# Altium project MotorBase.PrjPcb
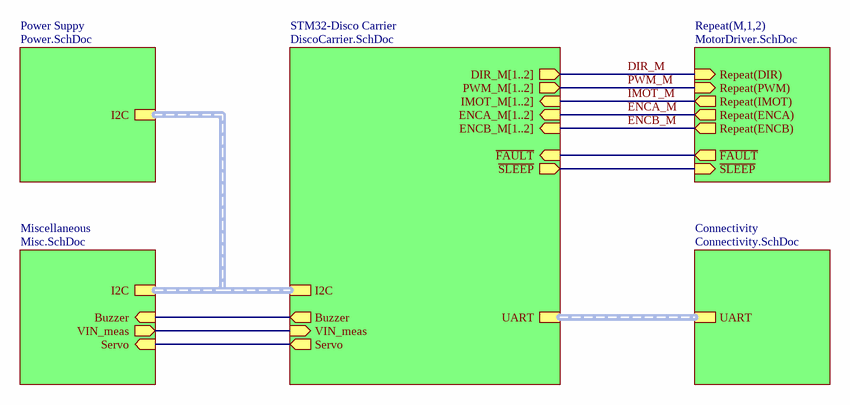
[diagram p0: Top.SchDoc]
seAuthor: Stefan Lüthi; seProject: robby; seRevision: 1.0
6 sheets, 85 parts. Net scope: hierarchical (ports join the sheet entries above them; power ports are global).
Board file: MotorBase.PcbDoc
Sheets:
  Top.SchDoc
    STM32-Disco Carrier = DiscoCarrier.SchDoc
    Miscellaneous = Misc.SchDoc
    M1 = MotorDriver.SchDoc
    M2 = MotorDriver.SchDoc
    Power Suppy = Power.SchDoc
    Connectivity = Connectivity.SchDoc

## Sheet Top.SchDoc
size A4; SheetNumber: 1; SheetTotal: 6

### Sub-sheets
Connectivity = Connectivity.SchDoc: UART (harness UART)
Miscellaneous = Misc.SchDoc: Buzzer (in), I2C (harness I2C), VIN_meas (out), Servo (in)
Power Suppy = Power.SchDoc: I2C (harness I2C)
Repeat(M,1,2) = MotorDriver.SchDoc: ~{FAULT} (out), ~{SLEEP} (in), Repeat(DIR) (in), Repeat(PWM) (in), Repeat(IMOT) (out), Repeat(ENCA) (out), Repeat(ENCB) (out)
STM32-Disco Carrier = DiscoCarrier.SchDoc: ~{FAULT} (in), ~{SLEEP} (out), DIR_M[1..2] (out), PWM_M[1..2] (out), IMOT_M[1..2] (in), ENCA_M[1..2] (in), ENCB_M[1..2] (in), UART (harness UART), Buzzer (out), I2C (harness I2C), VIN_meas (in), Servo (out)

### Nets
Buz: sheet STM32-Disco Carrier/Buzzer, sheet Miscellaneous/Buzzer
DIR_M: sheet Repeat(M,1,2)/Repeat(DIR)
ENCA_M: sheet Repeat(M,1,2)/Repeat(ENCA)
ENCB_M: sheet Repeat(M,1,2)/Repeat(ENCB)
~{FAULT}: sheet STM32-Disco Carrier/~{FAULT}, sheet Repeat(M,1,2)/~{FAULT}
IMOT_M: sheet Repeat(M,1,2)/Repeat(IMOT)
PWM_M: sheet Repeat(M,1,2)/Repeat(PWM)
~{SLEEP}: sheet STM32-Disco Carrier/~{SLEEP}, sheet Repeat(M,1,2)/~{SLEEP}
VIN_meas: sheet STM32-Disco Carrier/VIN_meas, sheet Miscellaneous/VIN_meas
NetP304_6: sheet STM32-Disco Carrier/Servo, sheet Miscellaneous/Servo

### Buses and harness runs
harness sheet Connectivity/UART = sheet STM32-Disco Carrier/UART
harness sheet Miscellaneous/I2C = sheet Power Suppy/I2C = sheet STM32-Disco Carrier/I2C

### Notes on the sheet
- Project:
- Board:
- Title:
- Size:
- Sheet:
- A4
- of
- Drawn by:
- Revision:
- Date:
- Variant:
- Source Engineers GmbH | CH-3012 Bern
- File:

## Sheet DiscoCarrier.SchDoc
size A4; SheetNumber: 3; SheetTotal: 6
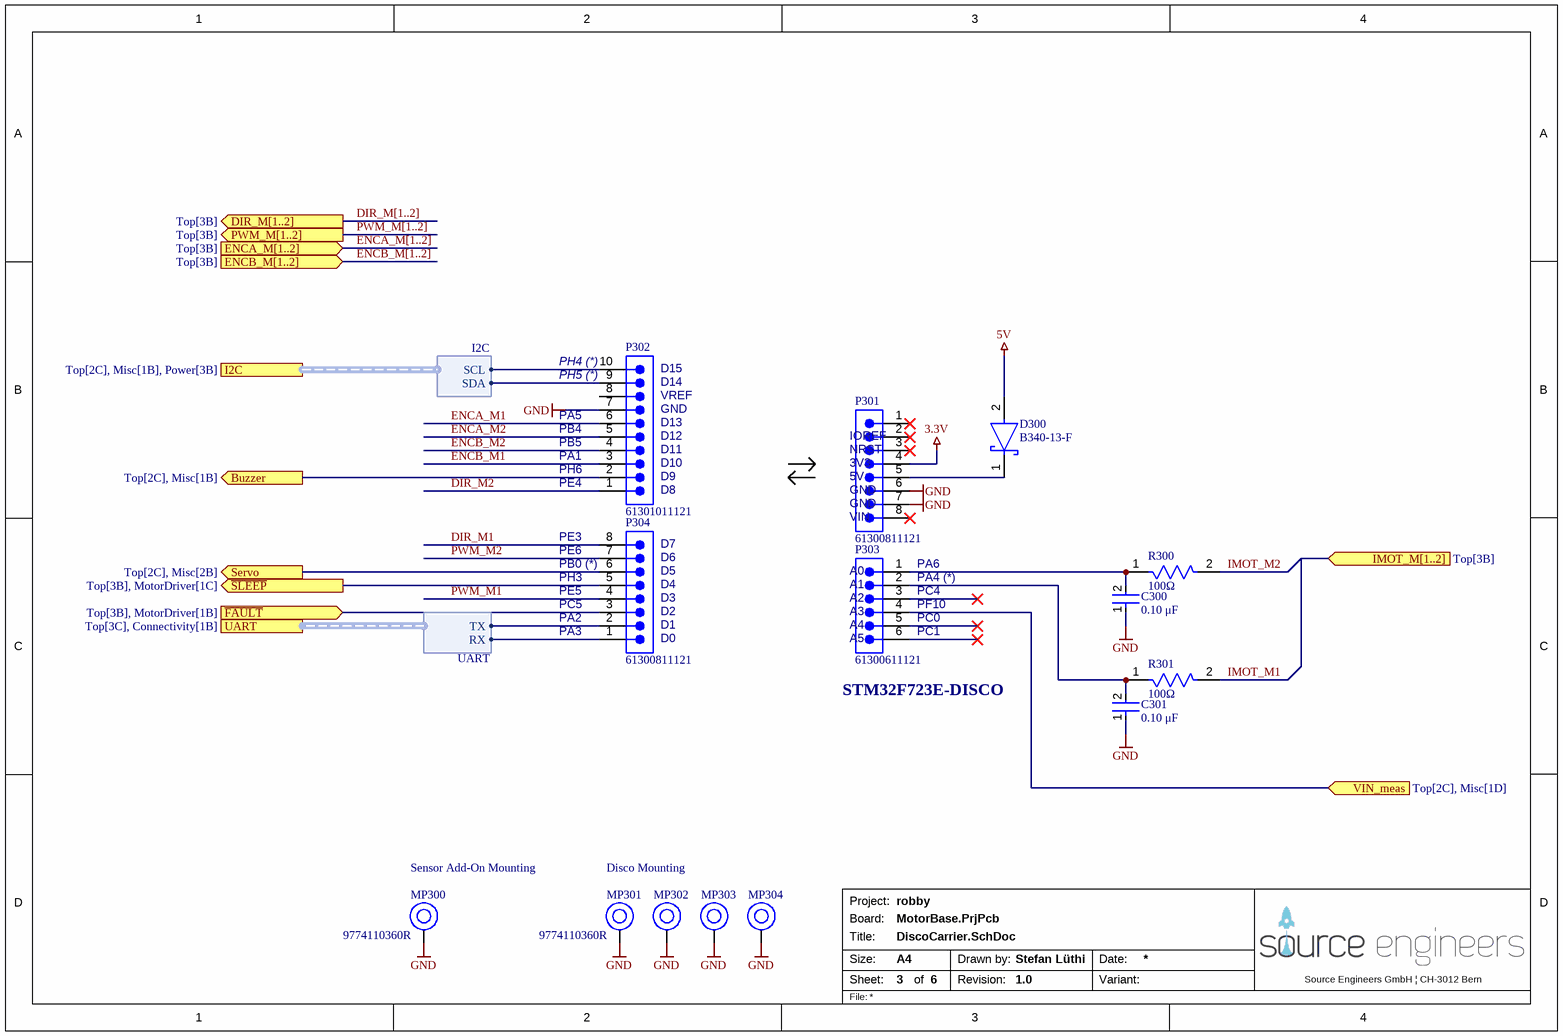
[diagram p1: DiscoCarrier.SchDoc]

### Parts
C300  value 0.10 μF  [FP-C0603C-CF-MFG]  (hidden comment: C0603C104M5RACTU)
C301  value 0.10 μF  [FP-C0603C-CF-MFG]  (hidden comment: C0603C104M5RACTU)
D300  B340-13-F  [FP-SMC-MFG]
MP300  9774110360R  [9774110360]
MP301  9774110360R  [9774110360]
MP302  9774110360R  [9774110360]  (value not drawn)
MP303  9774110360R  [9774110360]  (value not drawn)
MP304  9774110360R  [9774110360]  (value not drawn)
P301  61300811121  [61300811121]
P302  61301011121  [61301011121]
P303  61300611121  [61300611121]
P304  61300811121  [61300811121]
R300  Resistance: 100Ω  [FP-RT0603-MFG]  (hidden comment: RT0603FRE07100RL)
R301  Resistance: 100Ω  [FP-RT0603-MFG]  (hidden comment: RT0603FRE07100RL)

### Ports
Buzzer (out, see Top[2C], Misc[1B]), DIR_M[1..2] (out, see Top[3B]), ENCA_M[1..2] (in, see Top[3B]), ENCB_M[1..2] (in, see Top[3B]), I2C (harness I2C, see Top[2C], Misc[1B], Power[3B]), IMOT_M[1..2] (in, see Top[3B]), PWM_M[1..2] (out, see Top[3B]), Servo (out, see Top[2C], Misc[2B]), UART (harness UART, see Top[3C], Connectivity[1B]), VIN_meas (in, see Top[2C], Misc[1D]), ~{FAULT} (in, see Top[3B], MotorDriver[1B]), ~{SLEEP} (out, see Top[3B], MotorDriver[1C])

### Harnesses
UART: TX, RX
I2C: SCL, SDA

### Nets
3.3V: P301.4
5V: D300.2(A)
GND: C300.1 C301.1 MP300.1 MP301.1 MP302.1 MP303.1 MP304.1 P301.6 P301.7 P302.7
Buz: P302.2 ; port Buzzer
DIR_M1: P304.8
DIR_M2: P302.1
ENCA_M1: P302.6
ENCA_M2: P302.5
ENCB_M1: P302.3
ENCB_M2: P302.4
~{FAULT}: P304.3 ; port ~{FAULT}
IMOT_M1: R301.2
IMOT_M2: R300.2
PWM_M1: P304.4
PWM_M2: P304.7
~{SLEEP}: P304.5 ; port ~{SLEEP}
SCL: P302.10 ; port I2C.SCL
SDA: P302.9 ; port I2C.SDA
VIN_meas: P303.4 ; port VIN_meas
XIAO_RX: P304.2 ; port UART.TX
XIAO_TX: P304.1 ; port UART.RX
NetC300_2: C300.2 P303.1 R300.1
NetC301_2: C301.2 P303.2 R301.1
NetD300_1: D300.1(C) P301.5
NetP304_6: P304.6 ; port Servo

Not connected (* = marked no-connect by the designer): P301 1* 2* 3* 8*; P302 8; P303 3* 5* 6*

### Buses and harness runs
bus DIR_M[1..2] = port DIR_M[1..2]
bus ENCA_M[1..2] = port ENCA_M[1..2]
bus ENCB_M[1..2] = port ENCB_M[1..2]
bus PWM_M[1..2] = port PWM_M[1..2]

### Notes on the sheet
- (near P302) PH4 (*)
- (near P302) PH5 (*)
- (near P302) D14
- (near P302) D15
- (near P302) PB5
- (near P302) PB4
- (near P302) PA5
- (near P302) VREF
- (near P302) GND
- (near P302) D12
- (near P302) D13
- (near P301) IOREF
- (near P302) PA1
- PE4
- (near P302) PH6
- (near P302) D8
- (near P302) D9
- (near P302) D10
- (near P302) D11
- (near P301) NRST
- (near P301) 3V3
- (near P301) 5V
- (near P301) GND
- (near P301) VIN
- (near P304) PH3
- PE6
- PE3
- (near P304) PB0 (*)
- (near P304) D5
- (near P304) D6
- (near P304) D7
- (near P303) A0
- PA6
- (near P303) PA4 (*)
- (near P304) PA2
- (near P304) PC5
- (near P304) PE5
- (near P304) PA3
- (near P304) D0
- (near P304) D1
- (near P304) D2
- (near P304) D3
- (near P304) D4
- (near P303) A1
- (near P303) A2
- (near P303) A3
- (near P303) A4
- (near P303) A5
- (near P303) PC4
- (near P303) PF10
- (near P303) PC0
- (near P303) PC1
- STM32F723E-DISCO
- Sensor Add-On Mounting
- Disco Mounting
- Project:
- Board:
- Title:
- Size:
- Sheet:
- of
- Drawn by:
- Revision:
- Date:
- Variant:
- Source Engineers GmbH | CH-3012 Bern
- File:

### Library data of the parts
C300 C301 = CMP-2006-03068-2: CAP CER 0.1UF 50V 20% X7R 0603; Manufacturer: KEMET; Material: Ceramic; Tolerance: 0.2; Temperature Coefficient: 30ppm/°C; Automotive Grade: Grade 1; Temperature Range High: +125°C; Voltage Rating: 50 V; Device Class L3: Ceramic Capacitors; Manufacturer Part Number: C0603C104M5RACTU; Height: 0.87mm; Category: Cap; RoHS: TRUE; Digikey Description: CAP CER 0.1UF 50V 20% X7R 0603; ComponentLink2URL: https://api.kemet.com/component-edge/download/datasheet/C0603C100J5GACAUTO.pdf; Lead Free: Yes; Temperature Range Low: -55°C; Device Class L1: Passive Components; ComponentLink2Description: Datasheet; Temperature Characteristic: X7R; Automotive: Yes; Temperature: -55°C to +125°C; Octopart: https://octopart.com/c0603c104m5ractu-kemet-11855687; Device Class L2: Capacitors; Package: C0603C-CF; Mouser Description: Multilayer Ceramic Capacitors MLCC - SMD/SMT 50volts 0.1uF X7R 20%; Capacitance: 0.10 μF
D300 = CMP-12790-000049-1: DIODE SCHOTTKY 40V 3A SMC; Manufacturer: Diodes Inc.; Max Surge Forward Current: 100A; Peak Reverse Current: 0.1mA; Max Junction Temp: +150°C; Value: 200pF; Standoff Height: 0.1mm; Temperature: -55°C to +150°C; Reverse Voltage: 40V; Max Repetitive Reverse Voltage: 40V; Forward Current: 3A; Device Class L2: Diodes; RoHS: TRUE; Footprint Url: https://www.diodes.com/assets/Package-Files/SMC.pdf; Digikey Description: DIODE SCHOTTKY 40V 3A SMC; Package: SMC; Category: Diode; ComponentLink2Description: Datasheet; Temperature Range High: +150°C; Lead Free: Yes; Mouser Description: Diode Schottky 40V 3A 2-Pin SMC T/R Diode Schottky 40V 3A 2-Pin SMC T/R; Manufacturer Part Number: B340-13-F; Octopart: https://octopart.com/b340-13-f-diodes+inc.-325814; Automotive: No; ComponentLink2URL: https://www.diodes.com/assets/Datasheets/ds30923.pdf; Capacitance: 200pF; Device Class L1: Discrete Semiconductors; Temperature Range Low: -55°C; Height: 2.5mm; Device Class L3: Schottky Diodes
MP300-MP304 = CMP-03913-39399854-1: 9774110360R Spacer Material: Steel, Tin-Plated Mounting: SMT Series: WA-SMSI Thread D: M3; Plating: Tin; Threaded/Unthreaded: Threaded; Outside Diameter: 5.9944mm; Length: 11mm; Min Operating Temperature: -55°C; NexarPartId: 39399854; Packaging: Tape and Reel; Material: Steel; Thread Size: M3; Width: 6mm; REACH SVHC: Unknown; Max Operating Temperature: 150°C; Height: 11.1mm; Lead Free: Lead Free; RoHS: Compliant; Case/Package: SMD/SMT; Mount: External
P301 P304 = CMP-1502-01076-3: NexarPartId: 32855533; Connector Type: Male Pin; Number of Contacts: 8; Voltage Rating: 250V; Current Rating: 3A; Contact Resistance: 20mΩ; Pitch: 2.54mm; Gender: Male; Termination: Solder; Contact Material: Copper; Mount: Through Hole; Lead Pitch: 2.54mm; Number of Positions: 8; Operating Supply Voltage: 250V; Number of Pins: 8; Max Operating Temperature: 105°C; Height: 8.54mm; REACH SVHC: Unknown; Number of Rows: 1; Packaging: Bulk; Contact Plating: Gold; Contact Mating Length: 5.9944mm; Orientation: Vertical; RoHS: Compliant; Color: Black; Min Operating Temperature: -40°C
P302 = CMP-1502-01082-5: NexarPartId: 18818159; Gender: Male; Number of Positions: 10; Operating Supply Voltage: 250V; Current Rating: 3A; Contact Resistance: 20mΩ; Connector Type: Male Pin; Insulation Resistance: 1GΩ; Pitch: 2.54mm; Color: Black; Contact Gender: Male; Height: 8.74mm; Orientation: Vertical; RoHS: Compliant; Packaging: Bulk; Min Operating Temperature: -40°C; Number of Pins: 10; Max Operating Temperature: 105°C; REACH SVHC: Unknown; Voltage Rating: 250V; Number of Rows: 1; Housing Material: PBT; Number of Contacts: 10; Mount: Through Hole; Contact Mating Length: 5.9944mm; Length: 2.54mm; Lead Pitch: 2.54mm; Flammability Rating: UL94 V-0; Termination: Solder; Contact Material: Copper; Width: 25.4mm; Contact Plating: Gold
P303 = CMP-1502-01070-3: NexarPartId: 20084590; Current Rating: 3A; Pitch: 2.54mm; Gender: Male; Operating Supply Voltage: 250V; Connector Type: Male Pin; Number of Positions: 6; Contact Resistance: 20mΩ; Packaging: Bulk; Number of Pins: 6; Number of Rows: 1; Contact Plating: Gold; Lead Free: Lead Free; RoHS: Compliant; Contact Mating Length: 5.9944mm; Voltage Rating: 250V; REACH SVHC: Unknown; Contact Gender: Male; Housing Material: PBT; Min Operating Temperature: -40°C; Lead Pitch: 2.54mm; Mount: Through Hole; Number of Contacts: 6; Max Operating Temperature: 105°C; Contact Material: Copper; Orientation: Vertical; Termination: Through Hole; Color: Black; Height: 8.89mm
R300 R301 = CMP-03412-022806-1: RES SMD 100 OHM 1% 1/10W 0603; Manufacturer: Yageo; Value: 100Ω; Power Rating: 0.1W; Voltage Rating: 75V; Temperature Coefficient: 50 ppm/°C; Tolerance: 0.01; Manufacturer Part Number: RT0603FRE07100RL; Mouser Description: Thin Film Resistors - SMD 1/10W 100 ohm 1% 50ppm; Ipc Land Pattern Name: RESC16080X45; Height: 0.55mm; Category: Res; Temperature Range Low: -55°C; Lead Free: Yes; Automotive: No; Device Class L3: Chip SMD Resistors; ComponentLink2Description: Datasheet; Device Class L2: Resistors; RoHS: TRUE; Footprint Url: http://www.yageo.com/exep/pages/download/literatures/PYu-R_Mount_10.pdf; Digikey Description: RES SMD 100 OHM 1% 1/10W 0603; Temperature Range High: +155°C; Package: RT0603; Device Class L1: Passive Components; Series: RT; Temperature: -55°C to +155°C; Octopart: https://octopart.com/rt0603fre07100rl-yageo-39792638; Composition: Thin Film; ComponentLink2URL: http://www.yageo.com/documents/recent/PYu-RT_1-to-0.01_RoHS_L_9.pdf

## Sheet Misc.SchDoc
size A4; SheetNumber: 6; SheetTotal: 6
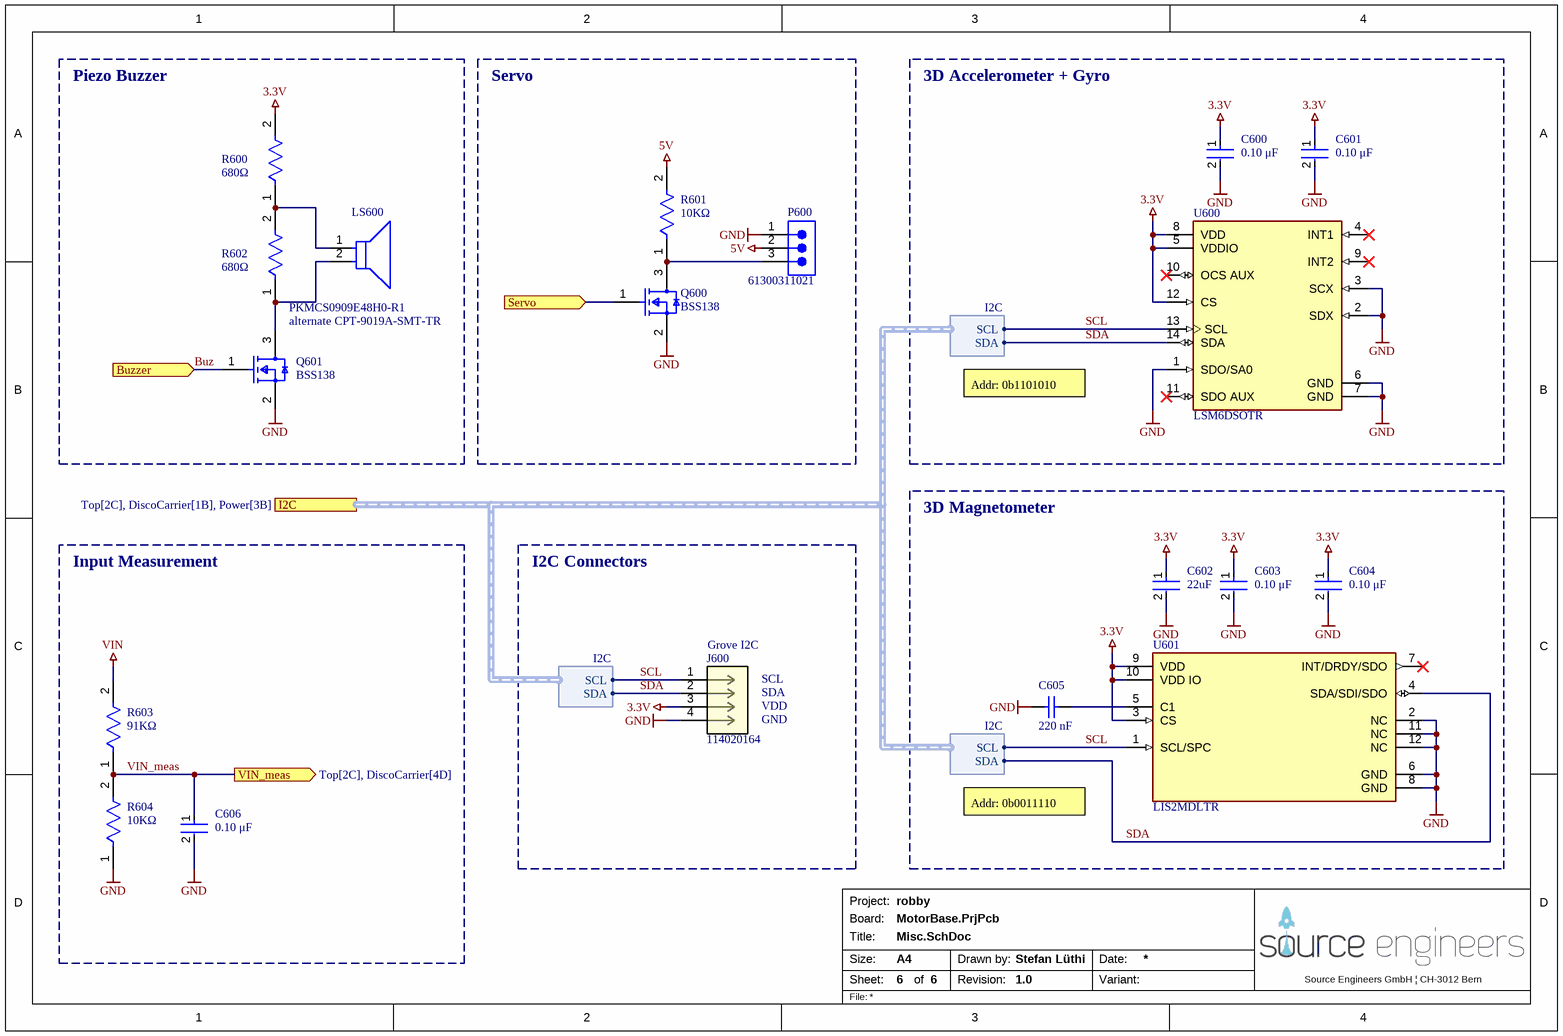
[diagram p2: Misc.SchDoc]

### Parts
C600  value 0.10 μF  [FP-C0603C-CF-MFG]  (hidden comment: C0603C104M5RACTU)
C601  value 0.10 μF  [FP-C0603C-CF-MFG]  (hidden comment: C0603C104M5RACTU)
C602  Capacitance: 22uF  [FP-GRM319-0_15-IPC_C]  (hidden comment: GRM319R61C226ME15D)
C603  value 0.10 μF  [FP-C0603C-CF-MFG]  (hidden comment: C0603C104M5RACTU)
C604  value 0.10 μF  [FP-C0603C-CF-MFG]  (hidden comment: C0603C104M5RACTU)
C605  value 220 nF  [CAPC1608X90X35NL15T15]  (hidden comment: C0603C224Z4VACTU)
C606  value 0.10 μF  [FP-C0603C-CF-MFG]  (hidden comment: C0603C104M5RACTU)
J600  114020164  [CONN4_20164_SEE]
LS600  PKMCS0909E48H0-R1  [FP-PKMCS0909E48H0-R1-MFG]
P600  61300311021  [61300311021]
Q600  BSS138  [FP-318-08-IPC_B]
Q601  BSS138  [FP-318-08-IPC_B]
R600  value 680Ω  [FP-RT0603-MFG]  (hidden comment: RT0603FRE07680RL)
R601  value 10KΩ  [FP-RT0603-MFG]  (hidden comment: RT0603FRE0710KL)
R602  value 680Ω  [FP-RT0603-MFG]  (hidden comment: RT0603FRE07680RL)
R603  Resistance: 91KΩ  [FP-RT0603-MFG]  (hidden comment: RT0603FRE0791KL)
R604  value 10KΩ  [FP-RT0603-MFG]  (hidden comment: RT0603FRE0710KL)
U600  LSM6DSOTR  [FP-LGA-14L-DM00249496-MFG]
U601  LIS2MDLTR  [FP-LGA-12-DM00170568-MFG]

### Blocks framed on the sheet
Piezo Buzzer: LS600 Q601 R600 R602
Servo: P600 Q600 R601
3D Accelerometer + Gyro: C600 C601 U600
3D Magnetometer: C602-C605 U601
Input Measurement: C606 R603 R604
I2C Connectors: J600

### Ports
Buzzer (in, see Top[2C], DiscoCarrier[1B]), I2C (harness I2C, see Top[2C], DiscoCarrier[1B], Power[3B]), Servo (in, see Top[2C], DiscoCarrier[1C]), VIN_meas (out, see Top[2C], DiscoCarrier[4D])

### Harnesses
I2C: SCL, SDA

### Nets
3.3V: C600.1 C601.1 C602.1 C603.1 C604.1 J600.3 R600.2 U600.5(VDDIO) U600.8(VDD) U600.12(CS) U601.3(CS) U601.9(VDD) U601.10(VDD_IO)
5V: P600.2 R601.2
GND: C600.2 C601.2 C602.2 C603.2 C604.2 C605.1 C606.2 J600.4 P600.1 Q600.2(S) Q601.2(S) R604.1 U600.1(SDO/SA0) U600.2(SDX) U600.3(SCX) U600.6(GND) U600.7(GND) U601.2(NC) U601.6(GND) U601.8(GND) U601.11(NC) U601.12(NC)
VIN: R603.2
Buz: Q601.1(G) ; port Buzzer
SCL: J600.1 U600.13(SCL) U601.1(SCL/SPC) ; port I2C.SCL
SDA: J600.2 U600.14(SDA) U601.4(SDA/SDI/SDO) ; port I2C.SDA
VIN_meas: C606.1 R603.1 R604.2 ; port VIN_meas
NetC605_2: C605.2 U601.5(C1)
NetLS600_1: LS600.1 R600.1 R602.2
NetLS600_2: LS600.2 Q601.3(D) R602.1
NetP304_6: Q600.1(G) ; port Servo
NetP600_3: P600.3 Q600.3(D) R601.1

Not connected (* = marked no-connect by the designer): U600 4(INT1)* 9(INT2)* 10(OCS_AUX)* 11(SDO_AUX)*; U601 7(INT/DRDY/SDO)*

### Notes on the sheet
- alternate CPT-9019A-SMT-TR
- Addr: 0b1101010
- (near J600) Grove I2C
- SCL
- SDA
- VDD
- GND
- Addr: 0b0011110
- Project:
- Board:
- Title:
- Size:
- Sheet:
- A4
- of
- Drawn by:
- Revision:
- Date:
- Variant:
- Source Engineers GmbH | CH-3012 Bern
- File:

### Library data of the parts
C600 C601 C603 C604 C606 = CMP-2006-03068-2: as C300 on sheet DiscoCarrier; Temperature Range High: +125°C; Voltage Rating: 50 V; Device Class L3: Ceramic Capacitors; Manufacturer Part Number: C0603C104M5RACTU; Height: 0.87mm; Category: Cap; RoHS: TRUE; Digikey Description: CAP CER 0.1UF 50V 20% X7R 0603; ComponentLink2URL: https://api.kemet.com/component-edge/download/datasheet/C0603C100J5GACAUTO.pdf; Lead Free: Yes; Temperature Range Low: -55°C; Device Class L1: Passive Components; ComponentLink2Description: Datasheet; Temperature Characteristic: X7R; Automotive: Yes; Temperature: -55°C to +125°C; Octopart: https://octopart.com/c0603c104m5ractu-kemet-11855687; Device Class L2: Capacitors; Package: C0603C-CF; Mouser Description: Multilayer Ceramic Capacitors MLCC - SMD/SMT 50volts 0.1uF X7R 20%; Capacitance: 0.10 μF
C602 = CMP-06035-037955-1: Chip Multilayer Ceramic Capacitors for General Purpose, 1206, 22uF, X5R, 15%, 20%, 16V; Weight: 0.001411oz; Case/Package: 1206; Mount: Surface Mount; Voltage Rating (DC): 16V; Case Code (Metric): 3216; Height: 0.85mm; Package Quantity: 4000; Resistor Type: Ceramic; Thickness: 0.037inch; Packaging: Tape and Reel; Dielectric: X5R; Tolerance: 20%; Case Code (Imperial): 1206; Width: 0.063inch; Termination: SMD/SMT; Voltage Rating: 16V; Length: 0.126inch; Min Operating Temperature: -55°C; Max Operating Temperature: 85°C
C605 = CMP-2006-02254-1: Manufacturer: Kemet; Part Number: C0603C224Z4VACTU
J600 = 114020164: No Description Available; Manufacturer_Name: BeagleBoard; Copyright: Copyright (C) 2025 Ultra Librarian. All rights reserved.; Manufacturer_Part_Number: 114020164; RefDes: RefDes; Type: Type; Supplier 1: DigiKey; Supplier Part Number 1: 1597-114020164-ND; Supplier 2: Mouser; Supplier Part Number 2: 713-114020164
LS600 = CMP-06202-000041-1: 9.09.0MM 4.8KHZ PIEZOELECTRIC SO
P600 = CMP-1502-01061-3: NexarPartId: 32855520; Contact Resistance: 20mΩ; Number of Positions: 3; Current Rating: 3A; Gender: Male; Operating Supply Voltage: 250V; Connector Type: Male Pin; Pitch: 2.54mm; Number of Rows: 1; Lead Pitch: 2.54mm; REACH SVHC: Unknown; Packaging: Bulk; Mount: Through Hole; Number of Pins: 3; Color: Black; Contact Plating: Gold; Contact Material: Copper; Number of Contacts: 3; Contact Mating Length: 5.9944mm; Termination: Solder; RoHS: Compliant
Q600 Q601 = CMP-07173-000101-1: MOSFET N-CH 50V 220MA SOT-23; Turn-Off Delay Time: 20ns; Element Configuration: Single; Rds On Max: 3.5R; Gate to Source Voltage (Vgs): 20V; Threshold Voltage: 1.3V; Number of Elements: 1; Power Dissipation: 360mW; Rise Time: 9ns; Turn-On Delay Time: 2.5ns; Input Capacitance: 27pF; On-State Resistance: 6R; Lead Free: Lead Free; Length: 2.92mm; Width: 1.3mm; Drain to Source Breakdown Voltage: 50V; Min Operating Temperature: -55°C; REACH SVHC: No SVHC; Packaging: Tape and Reel; Radiation Hardening: No; Height: 0.93mm; Drain to Source Voltage (Vdss): 50V; Current Rating: 220mA; Voltage Rating (DC): 50V; Weight: 0.03g; Continuous Drain Current (ID): 220mA; Number of Pins: 3; Nominal Vgs: 1.3V; Max Power Dissipation: 360mW; Fall Time: 9ns; Drain to Source Resistance: 3.5R; Contact Plating: Tin; Case/Package: SOT-23; Package Quantity: 1; Dual Supply Voltage: 50V; Mount: Surface Mount; Termination: SMD/SMT; Max Operating Temperature: 150°C
R600 R602 = CMP-03412-003342-1: RES SMD 680 OHM 1% 1/10W 0603; Manufacturer: Yageo; Temperature Coefficient: 50 ppm/°C; Tolerance: 0.01; Power Rating: 0.1W; Voltage Rating: 75V; Temperature Range Low: -55°C; Device Class L2: Resistors; Digikey Description: RES SMD 680 OHM 1% 1/10W 0603; Composition: Thin Film; ComponentLink2Description: Datasheet; Footprint Url: http://www.yageo.com/exep/pages/download/literatures/PYu-R_Mount_10.pdf; Mouser Description: Thin Film Resistors - SMD 1/10W 680 ohm 1% 50ppm; Series: RT; Resistance: 680Ω; Temperature Range High: +155°C; Octopart: https://octopart.com/rt0603fre07680rl-yageo-40000084; RoHS: TRUE; Temperature: -55°C to +155°C; Device Class L1: Passive Components; ComponentLink2URL: http://www.yageo.com/documents/recent/PYu-RT_1-to-0.01_RoHS_L_9.pdf; Automotive: No; Ipc Land Pattern Name: RESC16080X45; Height: 0.55mm; Package: RT0603; Category: Res; Manufacturer Part Number: RT0603FRE07680RL; Device Class L3: Chip SMD Resistors; Lead Free: Yes
R601 R604 = CMP-03412-005349-1: RES SMD 10K OHM 1% 1/10W 0603; Manufacturer: Yageo; Temperature Coefficient: 50 ppm/°C; Power Rating: 0.1W; Tolerance: 0.01; Voltage Rating: 75V; RoHS: TRUE; Category: Res; Automotive: No; Digikey Description: RES SMD 10K OHM 1% 1/10W 0603; ComponentLink2Description: Datasheet; Octopart: https://octopart.com/rt0603fre0710kl-yageo-40009243; ComponentLink2URL: http://www.yageo.com/documents/recent/PYu-RT_1-to-0.01_RoHS_L_9.pdf; Device Class L3: Chip SMD Resistors; Device Class L1: Passive Components; Temperature Range High: +155°C; Height: 0.55mm; Composition: Thin Film; Ipc Land Pattern Name: RESC16080X45; Series: RT; Package: RT0603; Resistance: 10KΩ; Footprint Url: http://www.yageo.com/exep/pages/download/literatures/PYu-R_Mount_10.pdf; Temperature: -55°C to +155°C; Temperature Range Low: -55°C; Lead Free: Yes; Device Class L2: Resistors; Mouser Description: Thin Film Resistors - SMD 10K ohm 1% 1/10W; Manufacturer Part Number: RT0603FRE0710KL
R603 = CMP-2000-04807-2: RES SMD 91K OHM 1% 1/10W 0603; Manufacturer: Yageo; Voltage Rating: 75V; Tolerance: 0.01; Value: 91KΩ; Power Rating: 0.1W; Temperature Coefficient: 50 ppm/°C; Series: RT; RoHS: TRUE; ComponentLink2Description: Datasheet; Temperature: -55°C to +155°C; Device Class L2: Resistors; Height: 0.55mm; Footprint Url: http://www.yageo.com/exep/pages/download/literatures/PYu-R_Mount_10.pdf; Manufacturer Part Number: RT0603FRE0791KL; Device Class L1: Passive Components; Device Class L3: Chip SMD Resistors; Temperature Range High: +155°C; Lead Free: Yes; Mouser Description: Thin Film Resistors - SMD 1/10W 91K ohm 1% 50ppm; Automotive: No; Ipc Land Pattern Name: RESC16080X45; Digikey Description: RES SMD 91K OHM 1% 1/10W 0603; Package: RT0603; ComponentLink2URL: http://www.yageo.com/documents/recent/PYu-RT_1-to-0.01_RoHS_L_9.pdf; Composition: Thin Film; Octopart: https://octopart.com/rt0603fre0791kl-yageo-1246954; Category: Res; Temperature Range Low: -55°C
U600 = CMP-12177-000012-1: CONSUMER MEMS; Manufacturer: STMicroelectronics; Gyro Range: 125/250/500/1000/2000°/s; Max Supply Voltage: 3.6V; Sensor Output: I2C,SPI; Operating Supply Current: 0.55mA; Accel Range: 2/4/8/16g; Min Supply Voltage: 1.62V; Sensor Type: Temperature,Accelerometer,Gyroscope; Height: 0.86mm; Automotive: No; Device Class L3: Inertial Measurement Units (IMUs); Device Class L1: Sensors; ComponentLink2Description: Datasheet; Device Class L2: Motion Sensors; Temperature: -40°C to +85°C; Package: LGA-14L-DM00249496; Octopart: https://octopart.com/lsm6dsotr-stmicroelectronics-81706672; Temperature Range Low: -40°C; Digikey Description: CONSUMER MEMS; ComponentLink2URL: https://www.st.com/resource/en/datasheet/lsm6dso.pdf; Manufacturer Part Number: LSM6DSOTR; Mouser Description: iNEMO inertial module: "always-on" integrated 3D accelerometer and 3D gyroscope; Footprint Url: https://www.st.com/content/ccc/resource/technical/document/technical_note/73/17/9c/16/dd/96/4a/01/CD00134799.pdf/files/CD00134799.pdf/jcr:content/translations/en.CD00134799.pdf; Lead Free: Yes; RoHS: TRUE; Category: IC; Temperature Range High: +85°C
U601 = CMP-12173-000002-1: SENSOR MR I2C/SPI 12LGA; Manufacturer: STMicroelectronics; Sensing Method: Magnetic; Min Supply Voltage: 1.71V; Sensor Output: I2C,SPI; Operating Supply Current: 50-200uA; Max Supply Voltage: 3.6V; Octopart: https://octopart.com/lis2mdltr-stmicroelectronics-81117311; RoHS: TRUE; Device Class L3: unset; Device Class L1: Sensors; ComponentLink2URL: https://www.st.com/resource/en/datasheet/lis2mdl.pdf; Automotive: No; Device Class L2: Magnetic Sensors; Lead Free: Yes; Temperature: -40°C to +85°C; Manufacturer Part Number: LIS2MDLTR; Temperature Range High: +85°C; Height: 0.7mm; Digikey Description: SENSOR MR I2C/SPI 12LGA; Category: IC; ComponentLink2Description: Datasheet; Package: LGA-12-DM00170568; Temperature Range Low: -40°C

## Sheet MotorDriver.SchDoc
size A4; SheetNumber: 4; SheetTotal: 6
Used 2 times, as channels M1, M2. Parts and nets are listed once, with the designators drawn on the sheet.
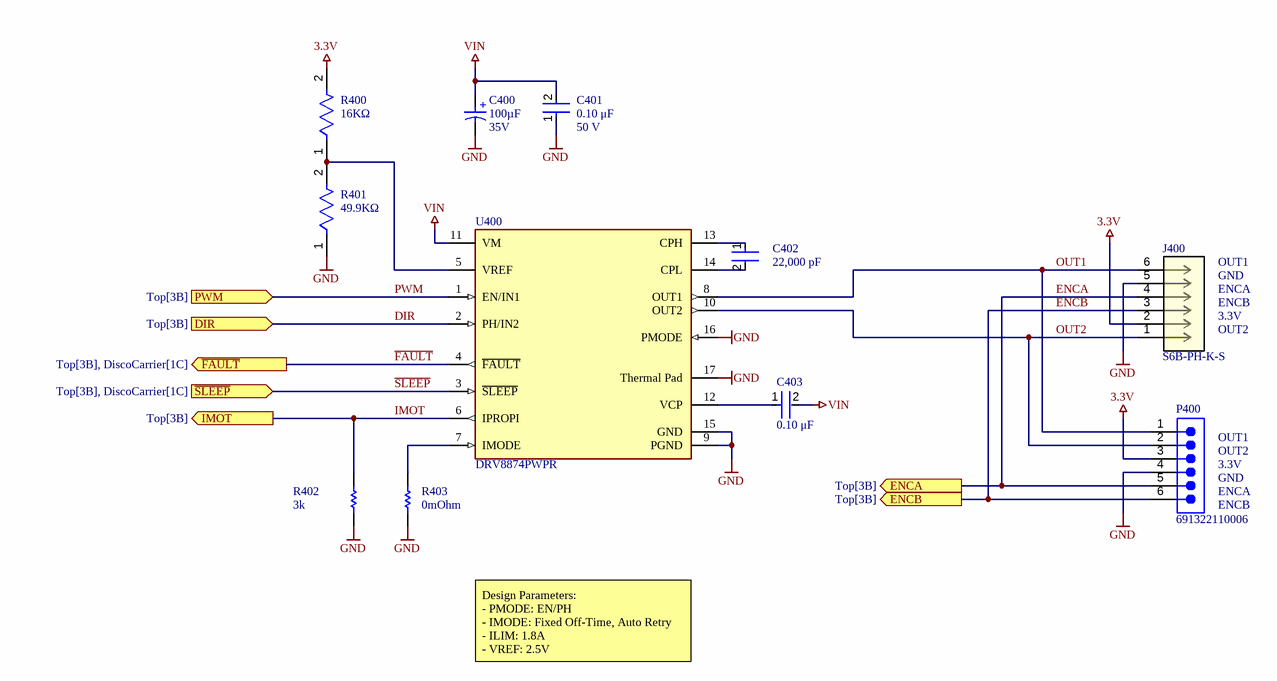
[diagram p3: MotorDriver.SchDoc]

### Parts
C400  Voltage Rating (DC): 35V  Capacitance: 100µF  [WCAP-ASLI_D6.3H7.7]  (hidden comment: 865080545012)
C401  value 0.10 μF  Voltage Rating: 50 V  [FP-C0603C-CF-MFG]  (hidden comment: C0603C104M5RACTU)
C402  value 22,000 pF  [FP-C0603C-CF-MFG]  (hidden comment: C0603C223M5RACTU)
C403  value 0.10 μF  [FP-C0603C-CF-MFG]  (hidden comment: C0603C104M5RACTU)
J400  S6B-PH-K-S  [CONN_S6B-PH-K-S_JST]
P400  691322110006  [691322110006]
R400  value 16KΩ  [FP-RT0603-MFG]  (hidden comment: RT0603FRE0716KL)
R401  value 49.9KΩ  [FP-RT0603-MFG]  (hidden comment: RT0603FRE0749K9L)
R402  Parameter 1: 3k  [RESC1608X55X25LL10T15]  (hidden comment: RT0603FRE073KL)
R403  Resistance: 0mOhm  [RESC1608X55X25ML10T15]  (hidden comment: RC0603JR-070RL)
U400  DRV8874PWPR  [FP-PWP0016J-MFG]

### Ports
DIR (in, see Top[3B]), ENCA (out, see Top[3B]), ENCB (out, see Top[3B]), IMOT (out, see Top[3B]), PWM (in, see Top[3B]), ~{FAULT} (out, see Top[3B], DiscoCarrier[1C]), ~{SLEEP} (in, see Top[3B], DiscoCarrier[1C])

### Nets
3.3V: J400.2 P400.3 R400.2
GND: C400.2(N) C401.1 J400.5 P400.4 R401.1 R402.1 R403.1 U400.9(PGND) U400.15(GND) U400.16(PMODE) U400.17(Thermal_Pad)
VIN: C400.1(P) C401.2 C403.2 U400.11(VM)
DIR: U400.2(PH/IN2) ; port DIR
ENCA: J400.4 P400.5 ; port ENCA
ENCB: J400.3 P400.6 ; port ENCB
~{FAULT}: U400.4(~{FAULT}) ; port ~{FAULT}
IMOT: R402.2 U400.6(IPROPI) ; port IMOT
OUT1: J400.6 P400.1 U400.8(OUT1)
OUT2: J400.1 P400.2 U400.10(OUT2)
PWM: U400.1(EN/IN1) ; port PWM
~{SLEEP}: U400.3(~{SLEEP}) ; port ~{SLEEP}
NetC402_1: C402.1 U400.13(CPH)
NetC402_2: C402.2 U400.14(CPL)
NetC403_1: C403.1 U400.12(VCP)
NetR400_1: R400.1 R401.2 U400.5(VREF)
NetR403_2: R403.2 U400.7(IMODE)

### Channels
M1: designators end in _M1; ports DIR=DIR_M1 ENCA=ENCA_M1 ENCB=ENCB_M1 IMOT=IMOT_M1 PWM=PWM_M1 ~{FAULT}=~{FAULT} ~{SLEEP}=~{SLEEP}
M2: designators end in _M2; ports DIR=DIR_M2 ENCA=ENCA_M2 ENCB=ENCB_M2 IMOT=IMOT_M2 PWM=PWM_M2 ~{FAULT}=~{FAULT} ~{SLEEP}=~{SLEEP}

### Notes on the sheet
- OUT1
- 3.3V
- GND
- ENCA
- ENCB
- OUT2
- (near P400) OUT1
- (near P400) OUT2
- (near P400) 3.3V
- (near P400) GND
- (near P400) ENCA
- (near P400) ENCB
- Design Parameters:
  - PMODE: EN/PH
  - IMODE: Fixed Off-Time, Auto Retry
  - ILIM: 1.8A
  - VREF: 2.5V
- Project:
- Board:
- Title:
- Size:
- Sheet:
- A4
- of
- Drawn by:
- Revision:
- Date:
- Variant:
- Source Engineers GmbH | CH-3012 Bern
- File:
- (in symbol CMP-03913-54202496-1) +

### Library data of the parts
C400 = CMP-03913-54202496-1: 865080545012 Cap Aluminum Lytic 100uF 35V 20% (6.3 X 7.7mm) SMD 300mA 2000h 105C T/R; Leakage Current: 35µA; Impedance: 380mΩ; Life (Hours): 2000hours; Dissipation Factor: 14%; Insulation Resistance: 1MΩ; ESR (Equivalent Series Resistance): 321.392mΩ; Case/Package: Radial; Packaging: Cut Tape; REACH SVHC: Unknown; Diameter: 6.3mm; Min Operating Temperature: -55°C; Ripple Current: 300mA; Height: 7.7mm; Voltage Rating: 35V; RoHS: Compliant; Width: 6.6mm; Ripple Current (AC): 300mA; NexarPartId: 54202496; Max Operating Temperature: 105°C; Tolerance: 20%; Length: 7.7mm
C401 C403 = CMP-2006-03068-2: as C300 on sheet DiscoCarrier; Temperature Range High: +125°C; Device Class L3: Ceramic Capacitors; Manufacturer Part Number: C0603C104M5RACTU; Height: 0.87mm; Category: Cap; RoHS: TRUE; Digikey Description: CAP CER 0.1UF 50V 20% X7R 0603; ComponentLink2URL: https://api.kemet.com/component-edge/download/datasheet/C0603C100J5GACAUTO.pdf; Lead Free: Yes; Temperature Range Low: -55°C; Device Class L1: Passive Components; ComponentLink2Description: Datasheet; Temperature Characteristic: X7R; Automotive: Yes; Temperature: -55°C to +125°C; Octopart: https://octopart.com/c0603c104m5ractu-kemet-11855687; Device Class L2: Capacitors; Package: C0603C-CF; Mouser Description: Multilayer Ceramic Capacitors MLCC - SMD/SMT 50volts 0.1uF X7R 20%; Capacitance: 0.10 μF
  C403: Voltage Rating: 50 V
C402 = CMP-2006-03144-2: CAP CER 0.022UF 50V X7R 0603; Manufacturer: KEMET; Automotive Grade: Grade 1; Temperature Coefficient: 30ppm/°C; Material: Ceramic; Tolerance: 0.2; Manufacturer Part Number: C0603C223M5RACTU; Device Class L3: Ceramic Capacitors; Octopart: https://octopart.com/c0603c223m5ractu-kemet-18481184; Height: 0.87mm; Device Class L1: Passive Components; RoHS: TRUE; Temperature Characteristic: X7R; ComponentLink2Description: Datasheet; ComponentLink2URL: https://api.kemet.com/component-edge/download/datasheet/C0603C100J5GACAUTO.pdf; Category: Cap; Temperature Range Low: -55°C; Digikey Description: CAP CER 0.022UF 50V X7R 0603; Automotive: Yes; Package: C0603C-CF; Lead Free: Yes; Temperature Range High: +125°C; Mouser Description: Cap Ceramic 0.022uF 50V X7R 20% SMD 0603 125°C Paper T/R; Voltage Rating: 50 V; Temperature: -55°C to +125°C; Capacitance: 22,000 pF; Device Class L2: Capacitors
J400 = S6B-PH-K-S: Description; Manufacturer_Name: JST; Copyright: Copyright (C) 2025 Ultra Librarian. All rights reserved.; Manufacturer_Part_Number: S6B-PH-K-S; RefDes: RefDes; Type: Type; Supplier 1: Mouser; Supplier Part Number 1: 306-S6B-PH-K-SLFSN; Supplier 2: DigiKey; Supplier Part Number 2: 455-1723-ND
P400 = CMP-1502-01795-2: NexarPartId: 18818350; Number of Contacts: 6; Voltage: 300V; Current: 10A; Number of Levels: 1; Pitch: 3.5052mm; Gender: Male; Connector Type: PCB, Terminal Block; REACH SVHC: Unknown; Height: 9.2mm; Width: 22.1mm; Number of Positions Per Level: 6; Contact Material: Brass; Mount: Through Hole; Contact Gender: Male; RoHS: Compliant; Packaging: Box; Color: Green; Length: 10.5mm; Lead Pitch: 3.5mm; Number of Rows: 1; Number of Pins: 6; Termination: Solder
R400 = CMP-2000-04660-2: RES SMD 16K OHM 1% 1/10W 0603; Manufacturer: Yageo; Voltage Rating: 75V; Temperature Coefficient: 50 ppm/°C; Power Rating: 0.1W; Tolerance: 0.01; Package: RT0603; Automotive: No; Octopart: https://octopart.com/rt0603fre0716kl-yageo-1480398; Manufacturer Part Number: RT0603FRE0716KL; Device Class L1: Passive Components; Composition: Thin Film; Height: 0.55mm; Footprint Url: http://www.yageo.com/exep/pages/download/literatures/PYu-R_Mount_10.pdf; Series: RT; Lead Free: Yes; Device Class L2: Resistors; Device Class L3: Chip SMD Resistors; ComponentLink2Description: Datasheet; Mouser Description: Thin Film Resistors - SMD 1/10W 16K ohm 1% 50ppm; ComponentLink2URL: http://www.yageo.com/documents/recent/PYu-RT_1-to-0.01_RoHS_L_9.pdf; Ipc Land Pattern Name: RESC16080X45; Resistance: 16KΩ; Category: Res; RoHS: TRUE; Temperature Range Low: -55°C; Temperature Range High: +155°C; Temperature: -55°C to +155°C; Digikey Description: RES SMD 16K OHM 1% 1/10W 0603
R401 = CMP-2000-04756-2: RES SMD 49.9K OHM 1% 1/10W 0603; Manufacturer: Yageo; Tolerance: 0.01; Voltage Rating: 75V; Temperature Coefficient: 50 ppm/°C; Power Rating: 0.1W; Height: 0.55mm; Series: RT; Footprint Url: http://www.yageo.com/exep/pages/download/literatures/PYu-R_Mount_10.pdf; Category: Res; Temperature: -55°C to +155°C; ComponentLink2URL: http://www.yageo.com/documents/recent/PYu-RT_1-to-0.01_RoHS_L_9.pdf; Temperature Range High: +155°C; Device Class L2: Resistors; Ipc Land Pattern Name: RESC16080X45; RoHS: TRUE; Composition: Thin Film; Package: RT0603; Automotive: No; Lead Free: Yes; Resistance: 49.9KΩ; Manufacturer Part Number: RT0603FRE0749K9L; Mouser Description: Thin Film Resistors - SMD 1/10W 49.9K ohm 1% 50ppm; Device Class L3: Chip SMD Resistors; Digikey Description: RES SMD 49.9K OHM 1% 1/10W 0603; ComponentLink2Description: Datasheet; Temperature Range Low: -55°C; Device Class L1: Passive Components; Octopart: https://octopart.com/rt0603fre0749k9l-yageo-1469374
R402 = CMP-2000-04746-1: Manufacturer: Yageo; Part Number: RT0603FRE073KL
R403 = CMP-2100-03667-1: Chip Resistor, 0 Ohm, +/- 5%, 0.1 W, -55 to 155 degC, 0603 (1608 Metric), RoHS, Tape and Reel; Manufacturer: Yageo; Temperature Coefficient: 200ppm/degreesC; Voltage Rating: 50V; Power Rating: 100mW; Width: 0.8mm; Max Operating Temperature: 155degC; Tolerance: 5%; Package Reference: 0603; Height: 0.45mm; Depth: 0.8mm; Package Description: 2-Pin Surface Mount Device, Body 1.6 x 0.8 mm; Termination: SMD/SMT; Package Quantity: 5000; Case/Package: 0603; Case Code (Imperial): 0603; Radiation Hardening: No; Number of Pins: 2; Length: 1.6mm; Lead Free: LeadFree; Voltage Rating (DC): 50V; Military Standard: Not; Datasheet URL: http://www.yageo.com/NewPortal/yageodocoutput?fileName=/pdf/R-Chip/PYu-RC_Group_51_RoHS_L_5.pdf; Manufacturer URL: http://www.yageo.com/; Packaging: TapeandReel; Case Code (Metric): 1608; Min Operating Temperature: -55degC; Composition: ThickFilm; RoHSCompliant: true; Contact Plating: Tin; Datasheet Version: Rev. 5, 10/2016; REACH SVHC: NoSVHC
U400 = CMP-04915-000011-1: DRV8874 H-BRIDGE MOTOR DRIVER; RoHS Compliant: Yes

## Sheet Power.SchDoc
size A4; SheetNumber: 2; SheetTotal: 6
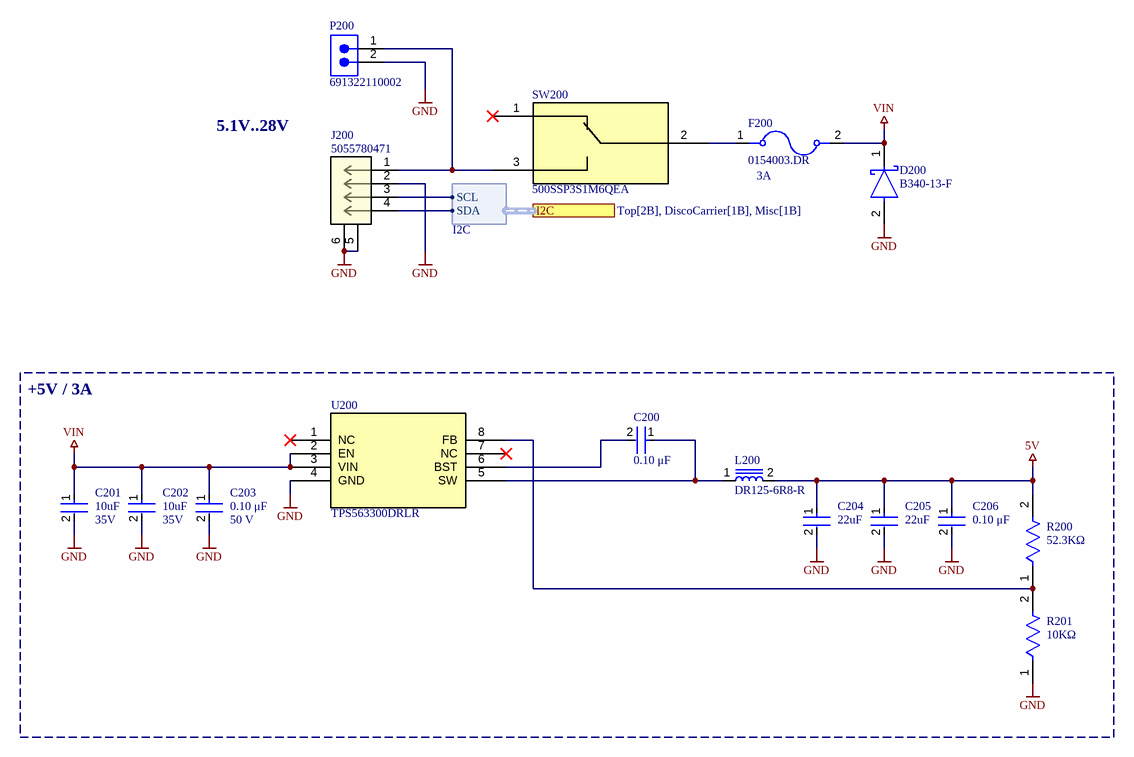
[diagram p4: Power.SchDoc]

### Parts
C200  value 0.10 μF  [FP-C0603C-CF-MFG]  (hidden comment: C0603C104M5RACTU)
C201  Capacitance: 10uF  Voltage Rating: 35V  [FP-GRT31C-0_2-IPC_A]  (hidden comment: GRT31CR6YA106KE01L)
C202  Capacitance: 10uF  Voltage Rating: 35V  [FP-GRT31C-0_2-IPC_A]  (hidden comment: GRT31CR6YA106KE01L)
C203  value 0.10 μF  Voltage Rating: 50 V  [FP-C0603C-CF-MFG]  (hidden comment: C0603C104M5RACTU)
C204  Capacitance: 22uF  [FP-GRM319-0_15-IPC_C]  (hidden comment: GRM319R61C226ME15D)
C205  Capacitance: 22uF  [FP-GRM319-0_15-IPC_C]  (hidden comment: GRM319R61C226ME15D)
C206  value 0.10 μF  [FP-C0603C-CF-MFG]  (hidden comment: C0603C104M5RACTU)
D200  B340-13-F  [FP-SMC-MFG]
F200  0154003.DR  value 3A  [FUSE_0154003.DR]
J200  5055780471  [CONN_505578_04_MOL]
L200  DR125-6R8-R  [INDM1250X1250X600]
P200  691322110002  [691322110002]
R200  value 52.3KΩ  [FP-RT0603-MFG]  (hidden comment: RT0603FRE0752K3L)
R201  value 10KΩ  [FP-RT0603-MFG]  (hidden comment: RT0603FRE0710KL)
SW200  500SSP3S1M6QEA  [SW3_500SSP3S1M6QEA_EWI]
U200  TPS563300DRLR  [SOT5X3-8_DRL_TEX]

### Blocks framed on the sheet
+5V / 3A: C200-C206 L200 R200 R201 U200

### Ports
I2C (harness I2C, see Top[2B], DiscoCarrier[1B], Misc[1B])

### Harnesses
I2C: SCL, SDA

### Nets
5V: C204.1 C205.1 C206.1 L200.2 R200.2
GND: C201.2 C202.2 C203.2 C204.2 C205.2 C206.2 D200.2(A) J200.2 J200.5 J200.6 P200.2 R201.1 U200.4(GND)
VIN: C201.1 C202.1 C203.1 D200.1(C) F200.2 U200.2(EN) U200.3(VIN)
SCL: J200.3 ; port I2C.SCL
SDA: J200.4 ; port I2C.SDA
NetC200_1: C200.1 L200.1 U200.5(SW)
NetC200_2: C200.2 U200.6(BST)
NetF200_1: F200.1 SW200.2
NetJ200_1: J200.1 P200.1 SW200.3
NetR200_1: R200.1 R201.2 U200.8(FB)

Not connected (* = marked no-connect by the designer): SW200 1*; U200 1(NC)* 7(NC)*

### Notes on the sheet
- 5.1V..28V
- Project:
- Board:
- Title:
- Size:
- Sheet:
- A4
- of
- Drawn by:
- Revision:
- Date:
- Variant:
- Source Engineers GmbH | CH-3012 Bern
- File:

### Library data of the parts
C200 C203 C206 = CMP-2006-03068-2: as C300 on sheet DiscoCarrier; Temperature Range High: +125°C; Device Class L3: Ceramic Capacitors; Manufacturer Part Number: C0603C104M5RACTU; Height: 0.87mm; Category: Cap; RoHS: TRUE; Digikey Description: CAP CER 0.1UF 50V 20% X7R 0603; ComponentLink2URL: https://api.kemet.com/component-edge/download/datasheet/C0603C100J5GACAUTO.pdf; Lead Free: Yes; Temperature Range Low: -55°C; Device Class L1: Passive Components; ComponentLink2Description: Datasheet; Temperature Characteristic: X7R; Automotive: Yes; Temperature: -55°C to +125°C; Octopart: https://octopart.com/c0603c104m5ractu-kemet-11855687; Device Class L2: Capacitors; Package: C0603C-CF; Mouser Description: Multilayer Ceramic Capacitors MLCC - SMD/SMT 50volts 0.1uF X7R 20%; Capacitance: 0.10 μF
  C200 C206: Voltage Rating: 50 V
C201 C202 = CMP-06035-017590-1: Multi-Layer Ceramic Capacitor 10uF 35V X5R ±10% 1206 Emboss T/R; Width: 0.063inch; Tolerance: 10%; Ratings: AEC-Q200; Packaging: Tape and Reel; Min Operating Temperature: -55°C; Case Code (Imperial): 1206; Case/Package: 1206; Max Operating Temperature: 85°C; Thickness: 0.071inch; Case Code (Metric): 3216; Mount: Surface Mount; Length: 0.126inch
C204 C205 = CMP-06035-037955-1: as C602 on sheet Misc; Weight: 0.001411oz; Case/Package: 1206; Mount: Surface Mount; Voltage Rating (DC): 16V; Case Code (Metric): 3216; Height: 0.85mm; Package Quantity: 4000; Resistor Type: Ceramic; Thickness: 0.037inch; Packaging: Tape and Reel; Dielectric: X5R; Tolerance: 20%; Case Code (Imperial): 1206; Width: 0.063inch; Termination: SMD/SMT; Voltage Rating: 16V; Length: 0.126inch; Min Operating Temperature: -55°C; Max Operating Temperature: 85°C
D200 = CMP-12790-000049-1: as D300 on sheet DiscoCarrier; Temperature: -55°C to +150°C; Reverse Voltage: 40V; Max Repetitive Reverse Voltage: 40V; Forward Current: 3A; Device Class L2: Diodes; RoHS: TRUE; Footprint Url: https://www.diodes.com/assets/Package-Files/SMC.pdf; Digikey Description: DIODE SCHOTTKY 40V 3A SMC; Package: SMC; Category: Diode; ComponentLink2Description: Datasheet; Temperature Range High: +150°C; Lead Free: Yes; Mouser Description: Diode Schottky 40V 3A 2-Pin SMC T/R Diode Schottky 40V 3A 2-Pin SMC T/R; Manufacturer Part Number: B340-13-F; Octopart: https://octopart.com/b340-13-f-diodes+inc.-325814; Automotive: No; ComponentLink2URL: https://www.diodes.com/assets/Datasheets/ds30923.pdf; Capacitance: 200pF; Device Class L1: Discrete Semiconductors; Temperature Range Low: -55°C; Height: 2.5mm; Device Class L3: Schottky Diodes
F200 = 0154003.DR: Nano2 SMD FF submin fuse w/holder, 3A | Littelfuse 0154003.DR; MF: Littelfuse Inc.; SnapEDA_Link: https://www.snapeda.com/parts/0154003.DR/Littelfuse/view-part/?ref=snap; Package: SMD-2 Littelfuse; MP: 0154003.DR; Check_prices: https://www.snapeda.com/parts/0154003.DR/Littelfuse/view-part/?ref=eda; Supplier 1: DigiKey; Supplier Part Number 1: F1226CT-ND; Supplier 2: DigiKey; Supplier Part Number 2: F1226DKR-ND; Supplier 3: Mouser; Supplier Part Number 3: 576-0154003.DR
J200 = 5055780471: 2.00mm Pitch, Micro-Lock Plus PCB Header, Single Row, Right-Angle, Surface Mount, Matte Tin Plating, Positive Lock, 4 Circuits, Low-Halogen, Black; Manufacturer_Name: Molex Connector Corporation; Copyright: Copyright (C) 2025 Ultra Librarian. All rights reserved.; Manufacturer_Part_Number: 5055780471; Datasheet: https://www.molex.com/en-us/products/part-detail-pdf/5055780471?display=pdf; RefDes: RefDes; Type: Type; Supplier 1: DigiKey; Supplier Part Number 1: WM17949CT-ND; Supplier 2: DigiKey; Supplier Part Number 2: WM17949DKR-ND; Supplier 3: Mouser; Supplier Part Number 3: 538-505578-0471
L200 = DR125-6R8-R: Inductor Power Shielded Drum Core 3.084u(OCL)H/3.3uH 20% 100KHz Ferrite 9.26A 6.3mOhm DCR T/R; Package: None; Price: None; Value: *; MP: DR125-6R8-R; Availability: Unavailable; Supplier 1: DigiKey; Supplier Part Number 1: 513-1530-1-ND; Supplier 2: DigiKey; Supplier Part Number 2: 513-1530-6-ND; Supplier 3: DigiKey; Supplier Part Number 3: 513-1530-2-ND; Supplier 4: Mouser; Supplier Part Number 4: 704-DR125-6R8-R
P200 = CMP-1502-01791-3: NexarPartId: 18818346; Voltage Rating: 300V; Number of Contacts: 2; Gender: Male; Current: 10A; Number of Levels: 1; Pitch: 3.5052mm; Termination: Solder; Lead Pitch: 3.5mm; Width: 8.1mm; Length: 10.5mm; Number of Positions Per Level: 2; Number of Pins: 2; Max Operating Temperature: 105°C; RoHS: Compliant; Current Rating: 10A; Voltage: 300V; Mount: Through Hole; Color: Green; Min Operating Temperature: -40°C; Height: 7.4mm; Number of Rows: 1; Packaging: Box; Lead Free: Lead Free; REACH SVHC: Unknown; Contact Material: Brass
R200 = CMP-03412-024293-1: RES SMD 52.3K OHM 1% 1/10W 0603; Manufacturer: Yageo; Tolerance: 0.01; Power Rating: 0.1W; Voltage Rating: 75V; Temperature Coefficient: 50 ppm/°C; Series: RT; Manufacturer Part Number: RT0603FRE0752K3L; Device Class L2: Resistors; Digikey Description: RES SMD 52.3K OHM 1% 1/10W 0603; Mouser Description: Thin Film Resistors - SMD 1/10W 52.3K ohm 1% 50ppm; Height: 0.55mm; Footprint Url: http://www.yageo.com/exep/pages/download/literatures/PYu-R_Mount_10.pdf; RoHS: TRUE; Device Class L3: Chip SMD Resistors; Temperature Range Low: -55°C; Lead Free: Yes; Category: Res; Composition: Thin Film; Automotive: No; ComponentLink2URL: http://www.yageo.com/documents/recent/PYu-RT_1-to-0.01_RoHS_L_9.pdf; Temperature: -55°C to +155°C; Device Class L1: Passive Components; Ipc Land Pattern Name: RESC16080X45; Octopart: https://octopart.com/rt0603fre0752k3l-yageo-1195990; ComponentLink2Description: Datasheet; Package: RT0603; Resistance: 52.3KΩ; Temperature Range High: +155°C
R201 = CMP-03412-005349-1: as R601 on sheet Misc; RoHS: TRUE; Category: Res; Automotive: No; Digikey Description: RES SMD 10K OHM 1% 1/10W 0603; ComponentLink2Description: Datasheet; Octopart: https://octopart.com/rt0603fre0710kl-yageo-40009243; ComponentLink2URL: http://www.yageo.com/documents/recent/PYu-RT_1-to-0.01_RoHS_L_9.pdf; Device Class L3: Chip SMD Resistors; Device Class L1: Passive Components; Temperature Range High: +155°C; Height: 0.55mm; Composition: Thin Film; Ipc Land Pattern Name: RESC16080X45; Series: RT; Package: RT0603; Resistance: 10KΩ; Footprint Url: http://www.yageo.com/exep/pages/download/literatures/PYu-R_Mount_10.pdf; Temperature: -55°C to +155°C; Temperature Range Low: -55°C; Lead Free: Yes; Device Class L2: Resistors; Mouser Description: Thin Film Resistors - SMD 10K ohm 1% 1/10W; Manufacturer Part Number: RT0603FRE0710KL
SW200 = 500SSP3S1M6QEA: No Description Available; Manufacturer_Name: E-Switch; Copyright: Copyright (C) 2025 Ultra Librarian. All rights reserved.; Manufacturer_Part_Number: 500SSP3S1M6QEA; RefDes: RefDes; Type: Type; Supplier 1: DigiKey; Supplier Part Number 1: 500SSP3S1M6QEA-ND; Supplier 2: Mouser; Supplier Part Number 2: 612-500SSP3S1M6QEA
U200 = TPS563300DRLR: 3.8-V to 28-V Input, 3-A synchronous buck converter in SOT-583 package 8-SOT-5X3 -40 to 150; Manufacturer_Name: Texas Instruments; Copyright: Copyright (C) 2025 Ultra Librarian. All rights reserved.; Manufacturer_Part_Number: TPS563300DRLR; RefDes: RefDes; Type: Type; Supplier 1: DigiKey; Supplier Part Number 1: 296-TPS563300DRLRCT-ND; Supplier 2: DigiKey; Supplier Part Number 2: 296-TPS563300DRLRDKR-ND; Supplier 3: Mouser; Supplier Part Number 3: 595-TPS563300DRLR

## Sheet Connectivity.SchDoc
size A4; SheetNumber: 5; SheetTotal: 6
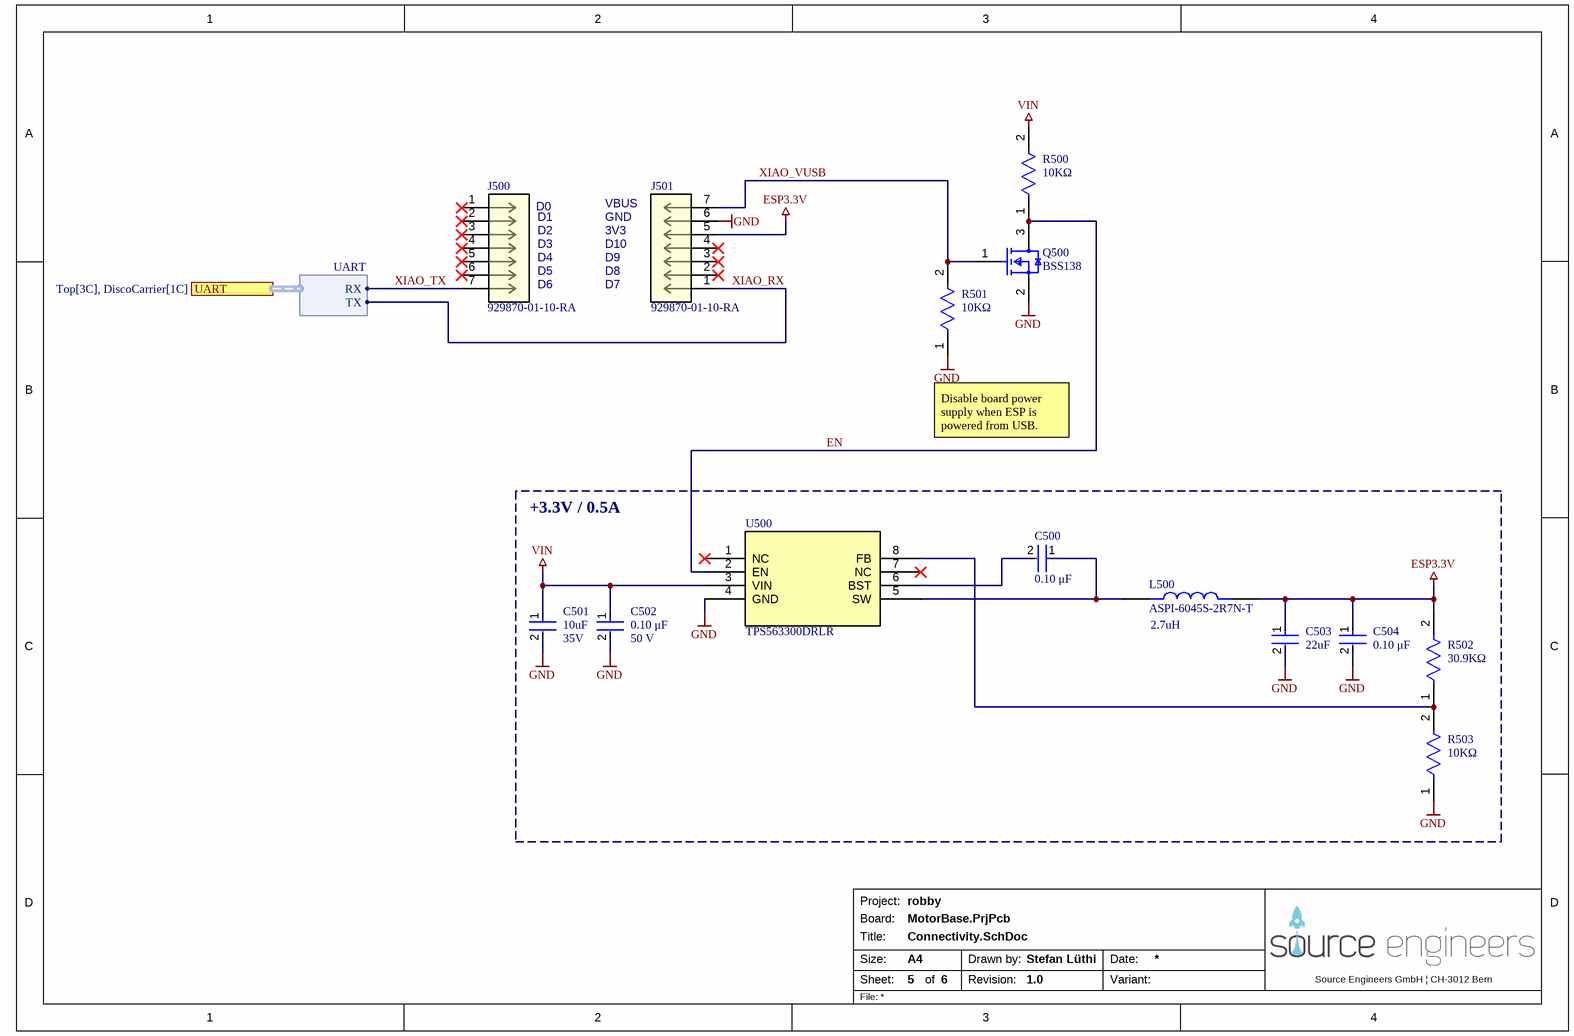
[diagram p5: Connectivity.SchDoc]

### Parts
C500  value 0.10 μF  [FP-C0603C-CF-MFG]  (hidden comment: C0603C104M5RACTU)
C501  Capacitance: 10uF  Voltage Rating: 35V  [FP-GRT31C-0_2-IPC_A]  (hidden comment: GRT31CR6YA106KE01L)
C502  value 0.10 μF  Voltage Rating: 50 V  [FP-C0603C-CF-MFG]  (hidden comment: C0603C104M5RACTU)
C503  Capacitance: 22uF  [FP-GRM319-0_15-IPC_C]  (hidden comment: GRM319R61C226ME15D)
C504  value 0.10 μF  [FP-C0603C-CF-MFG]  (hidden comment: C0603C104M5RACTU)
J500  929870-01-10-RA  [CONN_929870-01-07-RA_3MM]
J501  929870-01-10-RA  [CONN_929870-01-07-RA_3MM]
L500  ASPI-6045S-2R7N-T  value 2.7uH  [IND_ASPI-6045S-2R7N-T]
Q500  BSS138  [FP-318-08-IPC_B]
R500  value 10KΩ  [FP-RT0603-MFG]  (hidden comment: RT0603FRE0710KL)
R501  value 10KΩ  [FP-RT0603-MFG]  (hidden comment: RT0603FRE0710KL)
R502  Resistance: 30.9KΩ  [FP-RT0603-MFG]  (hidden comment: RT0603FRE0730K9L)
R503  value 10KΩ  [FP-RT0603-MFG]  (hidden comment: RT0603FRE0710KL)
U500  TPS563300DRLR  [SOT5X3-8_DRL_TEX]

### Blocks framed on the sheet
+3.3V / 0.5A: C500-C504 L500 R502 R503 U500

### Ports
UART (harness UART, see Top[3C], DiscoCarrier[1C])

### Harnesses
UART: TX, RX

### Nets
ESP3.3V: C503.1 C504.1 J501.5 L500.2 R502.2
GND: C501.2 C502.2 C503.2 C504.2 J501.6 Q500.2(S) R501.1 R503.1 U500.4(GND)
VIN: C501.1 C502.1 R500.2 U500.3(VIN)
EN: Q500.3(D) R500.1 U500.2(EN)
XIAO_RX: J501.1 ; port UART.TX
XIAO_TX: J500.7 ; port UART.RX
XIAO_VUSB: J501.7 Q500.1(G) R501.2
NetC500_1: C500.1 L500.1 U500.5(SW)
NetC500_2: C500.2 U500.6(BST)
NetR502_1: R502.1 R503.2 U500.8(FB)

Not connected (* = marked no-connect by the designer): J500 1* 2* 3* 4* 5* 6*; J501 2* 3* 4*; U500 1(NC)* 7(NC)*

### Notes on the sheet
- (near J500) D0
- (near J500) D1
- (near J500) D2
- (near J500) D3
- D10
- 3V3
- GND
- VBUS
- (near J500) D4
- (near J500) D5
- (near J500) D6
- D7
- D8
- D9
- Disable board power supply when ESP is powered from USB.
- Project:
- Board:
- Title:
- Size:
- Sheet:
- A4
- of
- Drawn by:
- Revision:
- Date:
- Variant:
- Source Engineers GmbH | CH-3012 Bern
- File:

### Library data of the parts
C500 C502 C504 = CMP-2006-03068-2: as C300 on sheet DiscoCarrier; Temperature Range High: +125°C; Device Class L3: Ceramic Capacitors; Manufacturer Part Number: C0603C104M5RACTU; Height: 0.87mm; Category: Cap; RoHS: TRUE; Digikey Description: CAP CER 0.1UF 50V 20% X7R 0603; ComponentLink2URL: https://api.kemet.com/component-edge/download/datasheet/C0603C100J5GACAUTO.pdf; Lead Free: Yes; Temperature Range Low: -55°C; Device Class L1: Passive Components; ComponentLink2Description: Datasheet; Temperature Characteristic: X7R; Automotive: Yes; Temperature: -55°C to +125°C; Octopart: https://octopart.com/c0603c104m5ractu-kemet-11855687; Device Class L2: Capacitors; Package: C0603C-CF; Mouser Description: Multilayer Ceramic Capacitors MLCC - SMD/SMT 50volts 0.1uF X7R 20%; Capacitance: 0.10 μF
  C500 C504: Voltage Rating: 50 V
C501 = CMP-06035-017590-1: as C201 on sheet Power; Width: 0.063inch; Tolerance: 10%; Ratings: AEC-Q200; Packaging: Tape and Reel; Min Operating Temperature: -55°C; Case Code (Imperial): 1206; Case/Package: 1206; Max Operating Temperature: 85°C; Thickness: 0.071inch; Case Code (Metric): 3216; Mount: Surface Mount; Length: 0.126inch
C503 = CMP-06035-037955-1: as C602 on sheet Misc; Weight: 0.001411oz; Case/Package: 1206; Mount: Surface Mount; Voltage Rating (DC): 16V; Case Code (Metric): 3216; Height: 0.85mm; Package Quantity: 4000; Resistor Type: Ceramic; Thickness: 0.037inch; Packaging: Tape and Reel; Dielectric: X5R; Tolerance: 20%; Case Code (Imperial): 1206; Width: 0.063inch; Termination: SMD/SMT; Voltage Rating: 16V; Length: 0.126inch; Min Operating Temperature: -55°C; Max Operating Temperature: 85°C
J500 J501 = 929870-01-10-RA: No Description Available; Manufacturer_Name: 3M; Copyright: Copyright (C) 2025 Ultra Librarian. All rights reserved.; Manufacturer_Part_Number: 929870-01-10-RA; RefDes: RefDes; Type: Type; Supplier 1: DigiKey; Supplier Part Number 1: 3M157422-ND; Supplier 2: Mouser; Supplier Part Number 2: 517-929870-01-10-RA
Q500 = CMP-07173-000101-1: as Q600 on sheet Misc; Lead Free: Lead Free; Length: 2.92mm; Width: 1.3mm; Drain to Source Breakdown Voltage: 50V; Min Operating Temperature: -55°C; REACH SVHC: No SVHC; Packaging: Tape and Reel; Radiation Hardening: No; Height: 0.93mm; Drain to Source Voltage (Vdss): 50V; Current Rating: 220mA; Voltage Rating (DC): 50V; Weight: 0.03g; Continuous Drain Current (ID): 220mA; Number of Pins: 3; Nominal Vgs: 1.3V; Max Power Dissipation: 360mW; Fall Time: 9ns; Drain to Source Resistance: 3.5R; Contact Plating: Tin; Case/Package: SOT-23; Package Quantity: 1; Dual Supply Voltage: 50V; Mount: Surface Mount; Termination: SMD/SMT; Max Operating Temperature: 150°C
R500 R501 R503 = CMP-03412-005349-1: as R601 on sheet Misc; RoHS: TRUE; Category: Res; Automotive: No; Digikey Description: RES SMD 10K OHM 1% 1/10W 0603; ComponentLink2Description: Datasheet; Octopart: https://octopart.com/rt0603fre0710kl-yageo-40009243; ComponentLink2URL: http://www.yageo.com/documents/recent/PYu-RT_1-to-0.01_RoHS_L_9.pdf; Device Class L3: Chip SMD Resistors; Device Class L1: Passive Components; Temperature Range High: +155°C; Height: 0.55mm; Composition: Thin Film; Ipc Land Pattern Name: RESC16080X45; Series: RT; Package: RT0603; Resistance: 10KΩ; Footprint Url: http://www.yageo.com/exep/pages/download/literatures/PYu-R_Mount_10.pdf; Temperature: -55°C to +155°C; Temperature Range Low: -55°C; Lead Free: Yes; Device Class L2: Resistors; Mouser Description: Thin Film Resistors - SMD 10K ohm 1% 1/10W; Manufacturer Part Number: RT0603FRE0710KL
R502 = CMP-03412-002652-1: RES SMD 30.9K OHM 1% 1/10W 0603; Manufacturer: Yageo; Value: 30.9KΩ; Voltage Rating: 75V; Temperature Coefficient: 50 ppm/°C; Power Rating: 0.1W; Tolerance: 0.01; Temperature Range High: +155°C; Category: Res; Octopart: https://octopart.com/rt0603fre0730k9l-yageo-1413622; Series: RT; Device Class L3: Chip SMD Resistors; Mouser Description: Thin Film Resistors - SMD 1/10W 30.9K ohm 1% 50ppm; Height: 0.55mm; Ipc Land Pattern Name: RESC16080X45; Device Class L1: Passive Components; ComponentLink2Description: Datasheet; Device Class L2: Resistors; Temperature Range Low: -55°C; Lead Free: Yes; Temperature: -55°C to +155°C; RoHS: TRUE; Manufacturer Part Number: RT0603FRE0730K9L; Digikey Description: RES SMD 30.9K OHM 1% 1/10W 0603; Composition: Thin Film; Package: RT0603; ComponentLink2URL: http://www.yageo.com/documents/recent/PYu-RT_1-to-0.01_RoHS_L_9.pdf; Automotive: No; Footprint Url: http://www.yageo.com/exep/pages/download/literatures/PYu-R_Mount_10.pdf
U500 = TPS563300DRLR: as U200 on sheet Power; Copyright: Copyright (C) 2025 Ultra Librarian. All rights reserved.; Manufacturer_Part_Number: TPS563300DRLR; RefDes: RefDes; Type: Type; Supplier 1: DigiKey; Supplier Part Number 1: 296-TPS563300DRLRCT-ND; Supplier 2: DigiKey; Supplier Part Number 2: 296-TPS563300DRLRDKR-ND; Supplier 3: Mouser; Supplier Part Number 3: 595-TPS563300DRLR
L500 = ASPI-6045S-2R7N-T: Package: None; Price: None; MP: ASPI-6045S-2R7N-T; Availability: Unavailable; Supplier 1: DigiKey; Supplier Part Number 1: ASPI-6045S-2R7N-TCT-ND; Supplier 2: DigiKey; Supplier Part Number 2: ASPI-6045S-2R7N-TDKR-ND; Supplier 3: DigiKey; Supplier Part Number 3: ASPI-6045S-2R7N-TTR-ND; Supplier 4: Mouser; Supplier Part Number 4: 815-ASPI-6045S-2R7NT

## Nets that join several sheets
3.3V: DiscoCarrier (P301.4), Misc (13 pins), M1 (J400_M1.2 P400_M1.3 R400_M1.2), M2 (J400_M2.2 P400_M2.3 R400_M2.2)
5V: DiscoCarrier (D300.2), Misc (P600.2 R601.2), Power (5 pins)
GND: DiscoCarrier (10 pins), Misc (22 pins), M1 (11 pins), M2 (11 pins), Power (13 pins), Connectivity (9 pins)
VIN: Misc (R603.2), M1 (C400_M1.1 C401_M1.2 C403_M1.2 U400_M1.11), M2 (C400_M2.1 C401_M2.2 C403_M2.2 U400_M2.11), Power (7 pins), Connectivity (C501.1 C502.1 R500.2 U500.3)
Buz: DiscoCarrier (P302.2), Misc (Q601.1)
~{FAULT}: DiscoCarrier (P304.3), M1 (U400_M1.4), M2 (U400_M2.4)
NetP304_6: DiscoCarrier (P304.6), Misc (Q600.1)
~{SLEEP}: DiscoCarrier (P304.5), M1 (U400_M1.3), M2 (U400_M2.3)
SCL: DiscoCarrier (P302.10), Misc (J600.1 U600.13 U601.1), Power (J200.3)
SDA: DiscoCarrier (P302.9), Misc (J600.2 U600.14 U601.4), Power (J200.4)
VIN_meas: DiscoCarrier (P303.4), Misc (C606.1 R603.1 R604.2)
XIAO_RX: DiscoCarrier (P304.2), Connectivity (J501.1)
XIAO_TX: DiscoCarrier (P304.1), Connectivity (J500.7)

## Assembly variants
Default: not fitted C300 C301 P200 P400_M1 P400_M2
Screw Terminal: not fitted C300 C301 J200 J400_M1 J400_M2